# EAGLE design RadioHTC_STM_v3_top_cpu (EAGLE 7.7.0)
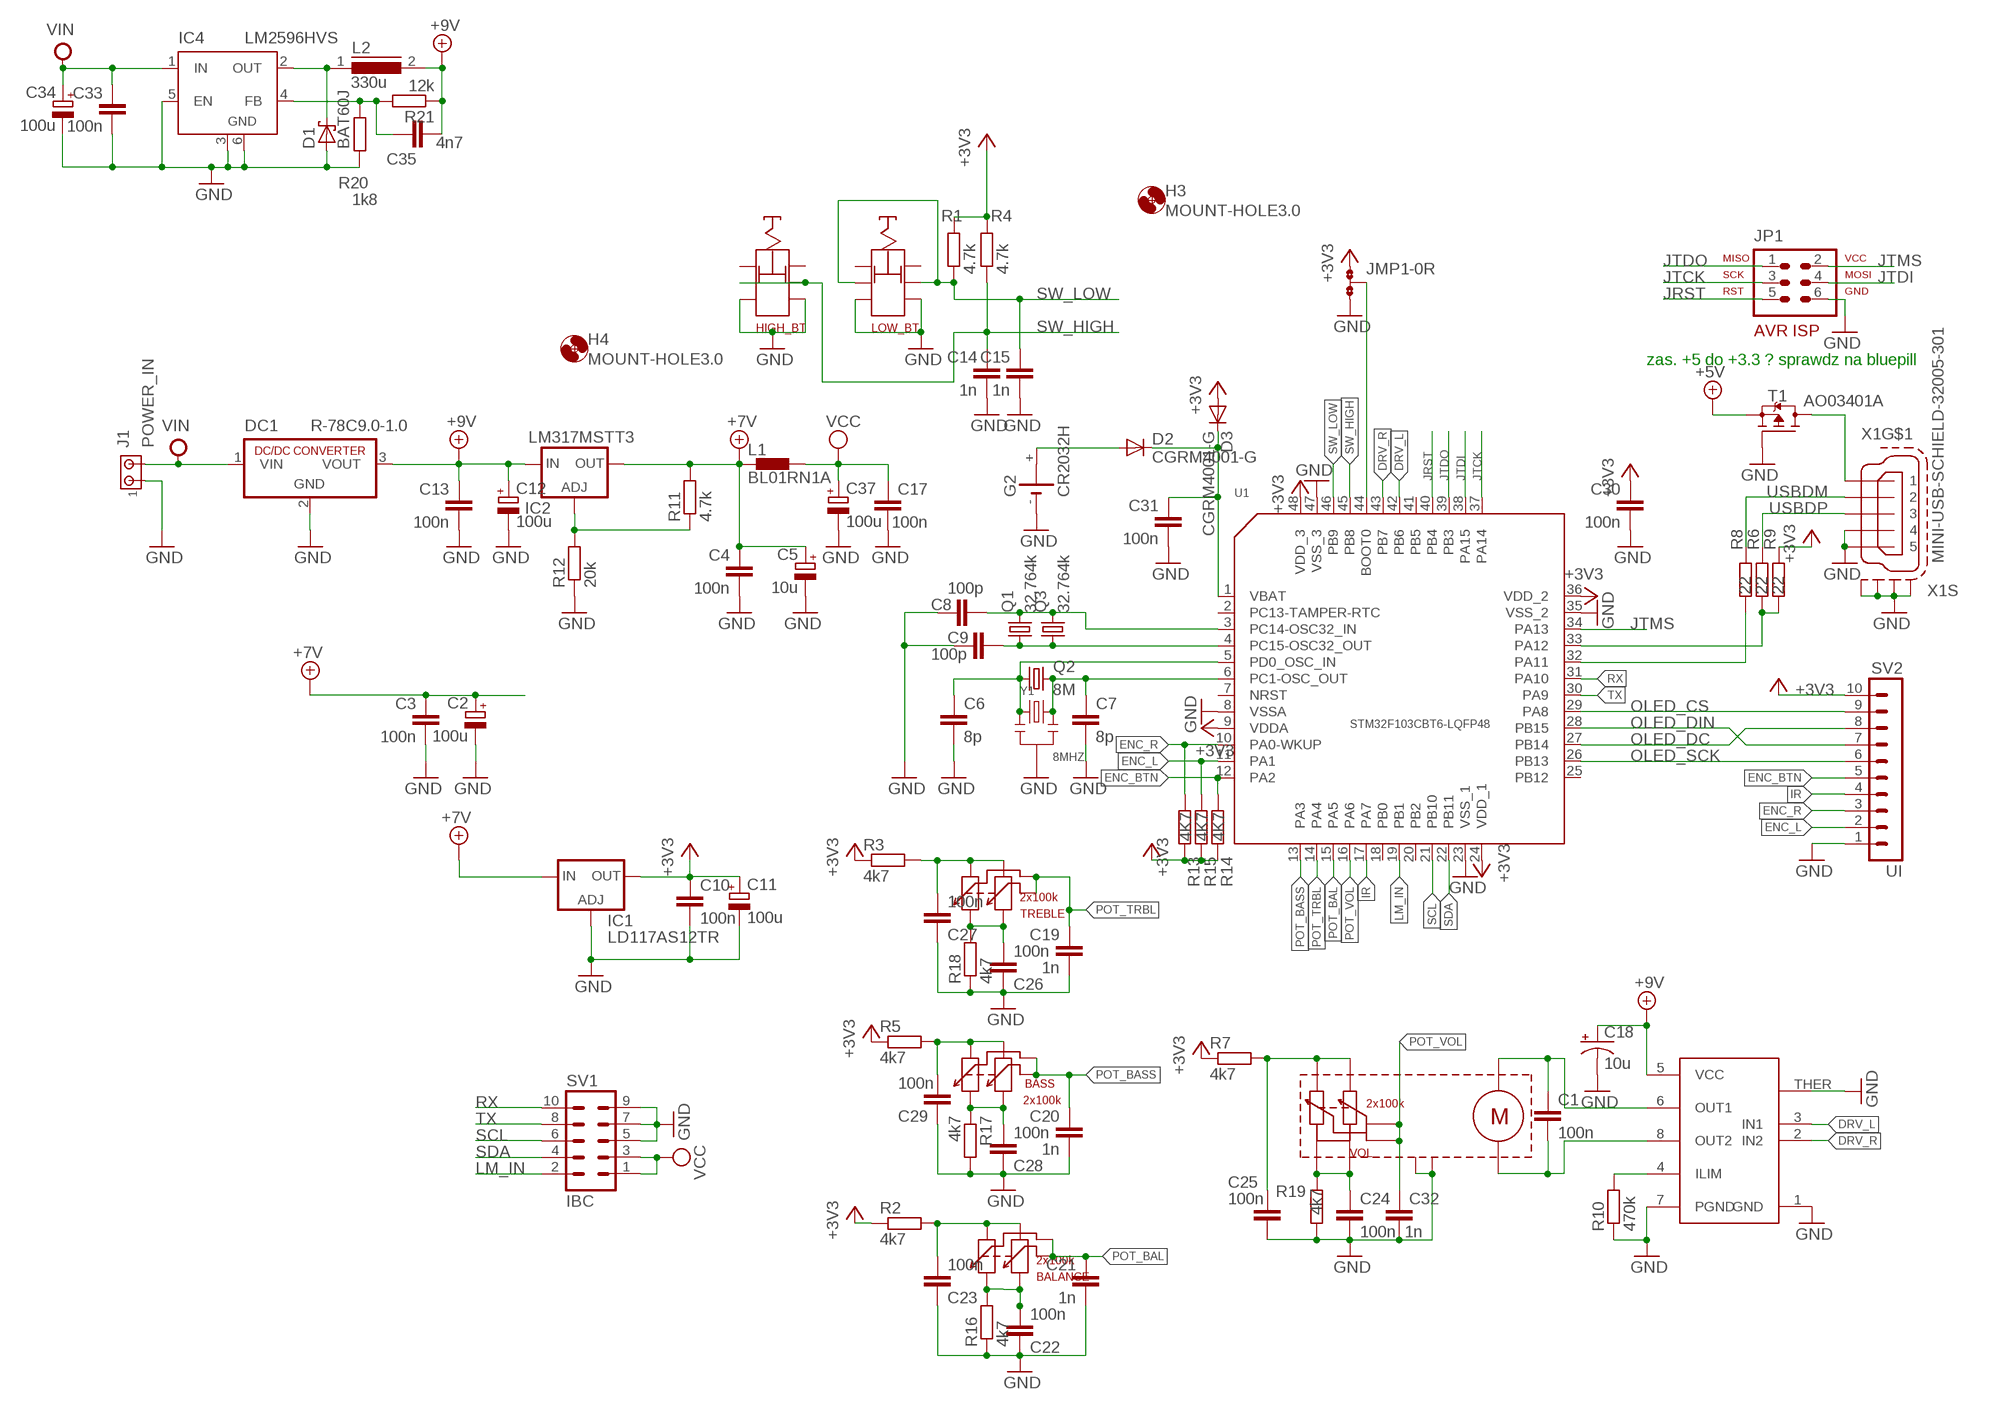
[diagram p0: schematic, sheet 1]

## Parts
BALANCE  2x100k  POT_TONSIL  [POT_VERT_DOUBLE]
BASS  2x100k  POT_TONSIL  [POT_VERT_DOUBLE]
C1  100n  C-EUC1206  [C1206]
C2  100u  CPOL-EUE2-5  [E2-5]
C3  100n  C-EUC1206  [C1206]
C4  100n  C-EUC1206  [C1206]
C5  10u  CPOL-EUE2-5  [E2-5]
C6  8p  C-EUC0805K  [C0805K]
C7  8p  C-EUC0805K  [C0805K]
C8  100p  C-EUC0805K  [C0805K]
C9  100p  C-EUC0805K  [C0805K]
C10  100n  C-EUC1206  [C1206]
C11  100u  CPOL-EUE2-5  [E2-5]
C12  100u  CPOL-EU153CLV-0605  [153CLV-0605]
C13  100n  C-EUC1206  [C1206]
C14  1n  C-EUC1206  [C1206]
C15  1n  C-EUC1206  [C1206]
C17  100n  C-EUC1206  [C1206]
C18  10u  CPOL-US153CLV-0810  [153CLV-0810]
C19  1n  C-EUC1206  [C1206]
C20  1n  C-EUC1206  [C1206]
C21  1n  C-EUC1206  [C1206]
C22  100n  C-EUC1206  [C1206]
C23  100n  C-EUC1206  [C1206]
C24  100n  C-EUC1206  [C1206]
C25  100n  C-EUC1206  [C1206]
C26  100n  C-EUC1206  [C1206]
C27  100n  C-EUC1206  [C1206]
C28  100n  C-EUC1206  [C1206]
C29  100n  C-EUC1206  [C1206]
C30  100n  C-EUC1206  [C1206]
C31  100n  C-EUC1206  [C1206]
C32  1n  C-EUC1206  [C1206]
C33  100n  C-EUC1206  [C1206]
C34  100u  CPOL-EUE2-5  [E2-5]
C35  4n7  C-EUC1206  [C1206]
C37  100u  CPOL-EU153CLV-0405  [153CLV-0405]
D1  BAT60J  [SOD323_ST]
D2  CGRM4001-G  [SOD-123_MINI-SMA]
D3  CGRM4001-G  [SOD-123_MINI-SMA]
DC1  R-78C9.0-1.0  [SIP3]
G2  CR2032H  [CR2032H]
H3  MOUNT-HOLE3.0  [3,0]
H4  MOUNT-HOLE3.0  [3,0]
IC1  LD117AS12TR  [SOT223]
IC2  LM317MSTT3  [SOT223]
IC4  LM2596HVS  LM2596S  [TO263-5]
J1  POWER_IN  MTA02-156  [1X2MTA]
JMP1  0R-JUMPA  [A0R-JMP]
JP1  AVR-ISP-6VERT  [AVR-ISP-6]
L1  BL01RN1A  [BL01RN1A]
L2  330u  DR74  [DR74]
Q1  32.764k  CRYSTALMM39SL  [MM39SL]
Q2  8M  CRYSTALHC49U-V  [HC49U-V]
Q3  32.764k  CRYSTALMM20SS  [MM20SS]
R1  4.7k  R-EU_R1206  [R1206]
R2  4k7  R-EU_R1206  [R1206]
R3  4k7  R-EU_R1206  [R1206]
R4  4.7k  R-EU_R1206  [R1206]
R5  4k7  R-EU_R1206  [R1206]
R6  22  R-EU_R1206  [R1206]
R7  4k7  R-EU_R1206  [R1206]
R8  22  R-EU_R1206  [R1206]
R9  22  R-EU_R1206  [R1206]
R10  470k  R-EU_R1206  [R1206]
R11  4.7k  R-EU_R1206  [R1206]
R12  20k  R-EU_R1206  [R1206]
R13  4K7  R-EU_R1206  [R1206]
R14  4K7  R-EU_R1206  [R1206]
R15  4K7  R-EU_R1206  [R1206]
R16  4k7  R-EU_R1206  [R1206]
R17  4k7  R-EU_R1206  [R1206]
R18  4k7  R-EU_R1206  [R1206]
R19  4k7  R-EU_R1206  [R1206]
R20  1k8  R-EU_R1206  [R1206]
R21  12k  R-EU_R1206  [R1206]
SV1  IBC  ML10  [ML10]
SV2  UI  MA10-1W  [MA10-1W]
SW4  LOW_BT  ISO3  [ISO3]
SW6  HIGH_BT  ISO3  [ISO3]
T1  AO03401A  P-MOSFET  [SOT23-R]
TREBLE  2x100k  POT_TONSIL  [POT_VERT_DOUBLE]
U1  STM32F103CBT6-LQFP48  MCU-STM32F103CBT6(LQFP48)  [LQFP48-0.5-7X7MM]
U2  DRV8871  [DRV8871]
VOL  2x100k  POT_DOUBLE_MOTOR  [POT_DOUBLE_MOTOR]
X1  MINI-USB-SCHIELD-32005-301  [32005-301]
Y1  8MHZ  SMD-RESONATOR-16MHZ-15PF-0.5%-40R(3P-3.2X1.3MM)  [X3-SMD-3.6X1.3X0.8MM]

## Nets
+3V3: C10.1 C11.+ C30.1 D3.A IC1.4(OUT) JMP1.1 R1.2 R2.1 R3.1 R4.2 R5.1 R7.1 R9.2 R13.2 R14.2 R15.2 SV2.10 U1.9(VDDA) U1.24(VDD_1) U1.36(VDD_2) U1.48(VDD_3)
+5V: T1.2(S)
+7V: C2.+ C3.1 C4.1 C5.+ IC1.3(IN) IC2.4(OUT) L1.1 R11.2
+9V: C12.+ C13.1 C18.+ C35.2 DC1.3(VOUT) IC2.3(IN) L2.2 R21.1 U2.5(VCC)
DRV_L: U1.42(PB6) U2.3(IN1)
DRV_R: U1.43(PB7) U2.2(IN2)
ENC_BTN: R14.1 SV2.5 U1.12(PA2)
ENC_L: R15.1 SV2.2 U1.11(PA1)
ENC_R: R13.1 SV2.3 U1.10(PA0-WKUP)
GND: C2.- C3.2 C4.2 C5.- C6.2 C7.2 C8.2 C9.1 C10.2 C11.- C12.- C13.2 C14.2 C15.2 C17.2 C18.- C19.2 C20.2 C21.2 C22.1 C23.1 C24.1 C25.1 C26.1 C27.1 C28.1 C29.1 C30.2 C31.2 C32.2 C33.2 C34.- C37.- D1.A DC1.2(GND) G2.- IC1.1(ADJ) IC4.3(GND) IC4.5(EN) IC4.6(GND) J1.1 JMP1.3 JP1.6 R10.1 R12.1 R16.1 R17.2 R18.1 R19.1 R20.1 SV1.5 SV1.7 SV1.9 SV2.1 SW4.P$3 SW4.P$4 SW6.P$3 SW6.P$4 T1.1(G) U1.8(VSSA) U1.23(VSS_1) U1.35(VSS_2) U1.47(VSS_3) U2.1(GND) U2.7(PGND) U2.THER(GND) VOL.P$9(G) VOL.P$10(G) X1.4 X1.5 X1.M1(S:S1) X1.M2(S:S2) X1.M3(S:S3) X1.M4(S:S4) Y1.2
IR: SV2.4 U1.17(PA7)
JRST: JP1.5 U1.40(PB4)
JTCK: JP1.3 U1.37(PA14)
JTDI: JP1.4 U1.38(PA15)
JTDO: JP1.1 U1.39(PB3)
JTMS: JP1.2 U1.34(PA13)
LM_IN: SV1.2 U1.19(PB1)
N$1: R10.2 U2.4(ILIM)
N$2: C6.1 Q2.1 U1.5(PD0_OSC_IN) Y1.1
N$3: T1.3(D) X1.1
N$4: IC2.1(ADJ) R11.1 R12.2
N$5: C7.1 Q2.2 U1.6(PC1-OSC_OUT) Y1.3
N$6: C9.2 Q1.1 Q3.1 U1.4(PC15-OSC32_OUT)
N$7: JMP1.2 U1.44(BOOT0)
N$8: C8.1 Q1.4 Q3.4 U1.3(PC14-OSC32_IN)
N$9: C35.1 IC4.4(FB) R20.2 R21.2
N$10: R6.1 R9.1 U1.33(PA12)
N$11: C31.1 D2.C D3.C U1.1(VBAT)
N$12: D2.A G2.+
N$13: R8.1 U1.32(PA11)
N$15: BASS.B1 BASS.B2 C28.2 R17.1
N$16: D1.C IC4.2(OUT) L2.1
N$17: BASS.A1 BASS.A2 C29.2 R5.2
N$18: C24.2 R19.2 VOL.P$5 VOL.P$6
N$19: BALANCE.B1 BALANCE.B2 C22.2 R16.2
N$21: C26.2 R18.2 TREBLE.B1 TREBLE.B2
N$39: C27.2 R3.2 TREBLE.A1 TREBLE.A2
N$40: BALANCE.A1 BALANCE.A2 C23.2 R2.2
N$41: C1.1 U2.6(OUT1) VOL.M+
N$42: C1.2 U2.8(OUT2) VOL.M-
N$43: C25.2 R7.2 VOL.P$2 VOL.P$3
OLED_CS: SV2.9 U1.29(PA8)
OLED_DC: SV2.8 U1.27(PB14)
OLED_DIN: SV2.7 U1.28(PB15)
OLED_SCK: SV2.6 U1.26(PB13)
POT_BAL: BALANCE.C1 BALANCE.C2 C21.1 U1.15(PA5)
POT_BASS: BASS.C1 BASS.C2 C20.1 U1.13(PA3)
POT_TRBL: C19.1 TREBLE.C1 TREBLE.C2 U1.14(PA4)
POT_VOL: C32.1 U1.16(PA6) VOL.P$4 VOL.P$7
RX: SV1.10 U1.31(PA10)
SCL: SV1.6 U1.21(PB10)
SDA: SV1.4 U1.22(PB11)
SW_HIGH: C14.1 R4.1 SW6.P$2 SW6.P$5 U1.45(PB8)
SW_LOW: C15.1 R1.1 SW4.P$2 SW4.P$5 U1.46(PB9)
TX: SV1.8 U1.30(PA9)
USBDM: R8.2 X1.2
USBDP: R6.2 X1.3
VCC: C17.1 C37.+ L1.2 SV1.1 SV1.3
VIN: C33.1 C34.+ DC1.1(VIN) IC4.1(IN) J1.2
Unconnected: SW4.P$1 SW4.P$6 SW6.P$1 SW6.P$6 U1.2(PC13-TAMPER-RTC) U1.7(NRST) U1.18(PB0) U1.20(PB2) U1.25(PB12) U1.41(PB5)

## Notes on the sheet
- zas. +5 do +3.3 ? sprawdz na bluepill

## Library data of the parts
BALANCE BASS TREBLE = Isostat:POT_TONSIL
C1 C3 C4 C6-C10 C13-C15 C17 C19-C33 C35 = rcl:C-EU: CAPACITOR, European symbol
C2 C5 C11 C12 C34 C37 = rcl:CPOL-EU: POLARIZED CAPACITOR, European symbol
C18 = rcl:CPOL-US: POLARIZED CAPACITOR, American symbol
D1 = diode:BAT60J: Schottky barrier diode Source: www.st.com, BAT60J.pdf
D2 D3 = diode:CGRM400*-G: Molded plasitc,JEDEC SOD-123/Mini SMA Source: Comchip CGRM4001-G.pdf
DC1 = dc-dc-converter:R-78C*-1.0: INNOLINE DC/DC-Converter 1.0 AMP SIP3 Single Output Source: Data sheet <http://www.mikrocontroller.net/attachment/150645/157764-da-01-en-DC_DC_WANDLER_R_78C5_0_1_0.pdf>
G2 = battery_cr2032:CR2032H: LI BATTERY Varta
H3 H4 = holes:MOUNT-HOLE: MOUNTING HOLE with drill center marker
IC1 = v-reg:LD117A?*: Low drop fixed and adjustable positive voltage regulators 1 A Source: http://www.st.com/stonline/products/literature/ds/7194/ld1117axx.pdf
IC2 = v-reg:LM317?*: 500 mA Adjustable Output Positive Voltage Regulator Source: http://www.onsemi.co.jp .. LM317M-D.PDF
IC4 = linear:LM2596S: STEP-DOWN VOLTAGE REGULATOR
J1 = con-amp:MTA02-156: AMP connector
JMP1 = jump-0r-smd:0R-JUMP: SMD 0R 0805 Jumper
JP1 = avr-7:AVR-ISP-6: AVR ISP-6 Serial Programming Header
L1 = inductors:BL0: Noise Suppression Products/EMI Suppression Filters, Lead EMIFIL(R) Inductor Type Source: http://www.murata.com .. BL01RN1_DS.pdf
L2 = inductors:DR74: High Power Density, High Efficiency, Shielded Inductors Source: coiltronics_dr_series.pdf
Q1 Q3 = crystal:CRYSTAL: CRYSTAL; OC_FARNELL: unknown; OC_NEWARK: unknown
Q2 = crystal:CRYSTAL: CRYSTAL; OC_FARNELL: 1666969; OC_NEWARK: unknown
R1-R21 = rcl:R-EU_: RESISTOR, European symbol
SV1 = con-harting-ml:ML10: HARTING; OC_FARNELL: unknown; OC_NEWARK: unknown
SV2 = con-lstb:MA10-1W: PIN HEADER; OC_FARNELL: unknown; OC_NEWARK: unknown
SW4 SW6 = Isostat:ISO3
T1 = BaseApp:P-MOSFET
U1 = Seeed-OPL-ic:MCU-STM32F103CBT6(LQFP48): 310010004; MPN: STM32F103CBT6
U2 = TEA5767:DRV8871
VOL = Isostat:POT_DOUBLE_MOTOR: TONSIL potenciometer with motor
X1 = con-cypressindustries:MINI-USB-SCHIELD-: MINI USB-B Conector Source: www.cypressindustries.com; OC_FARNELL: unknown; OC_NEWARK: unknown
Y1 = Seeed-OPL-Crystal-Oscillator:SMD-RESONATOR-16MHZ-15PF-0.5%-40R(3P-3.2X1.3MM): 306030002; MPN: CSTCE16M0V53-R0; VALUE: 16MHZ

## Net classes
1 +5V: width 0.813 mm, clearance 0.508 mm
2 w24: width 0.61 mm

## Board
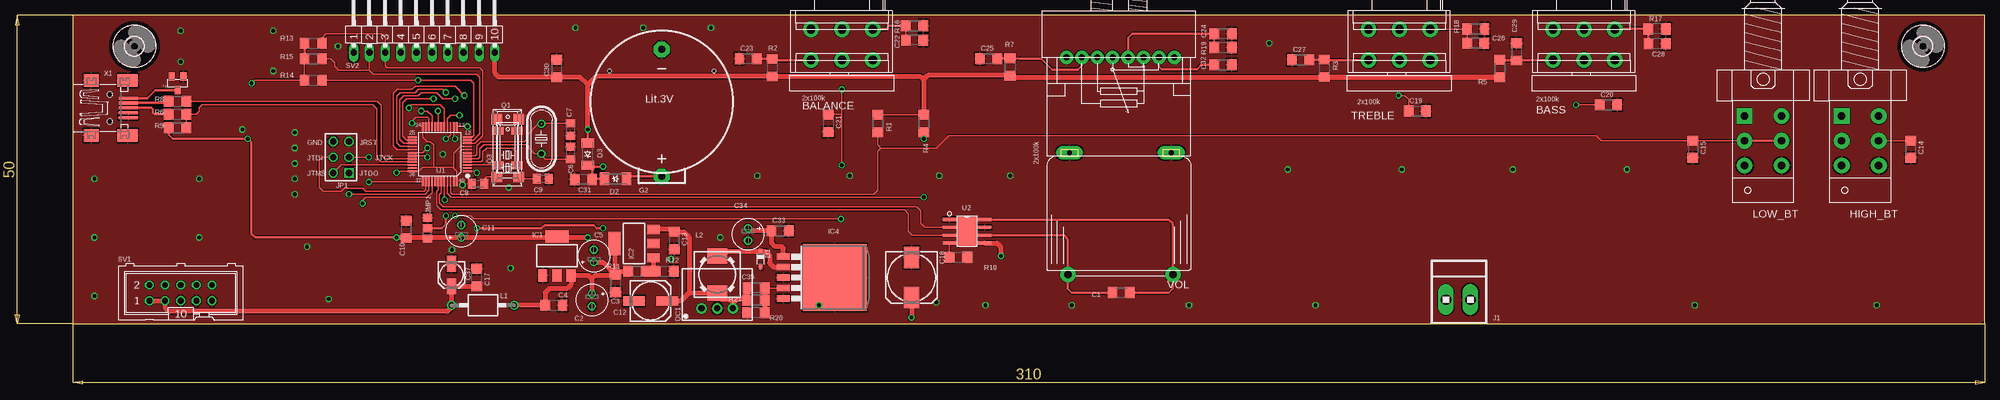
[diagram p1: board, top side]
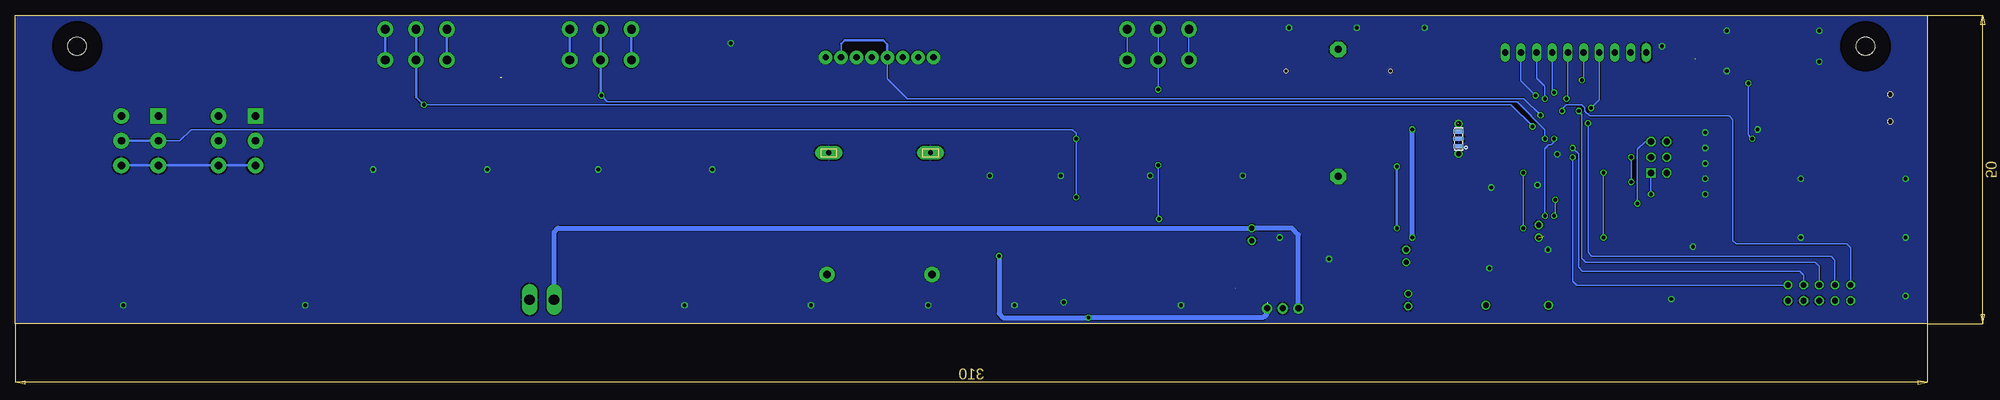
[diagram p2: board, bottom side, seen from below]

Size 310 x 50 mm. Coordinates in mm from the lower left corner, seen from the top.
Outline: 0,0 310,0 310,50 0,50 0,0
Copper layers (1*16): Top 0.035mm / dielectric 1.5mm / Bottom 0.035mm
Design rules "default *": minimum track width 10mil, minimum drill 0.6mm, track to track 4mil, track to pad 8mil, pad to pad 6mil, via to via 8mil, smd to smd 1mil, copper to edge 3mil, drill to drill 8mil, minimum pad ring 10mil, minimum via ring 8mil, stop-mask expansion 4mil, vias tented up to drill 0mil, thermal gap 10mil

### Footprints (pad centres in the part's own frame; a part is rotated, then mirrored left to right if it is on the bottom)
POT_VERT_DOUBLE = drill 1.4 pad 2.54: A1 0,-5; A2 5,-5; B1 0,5; B2 5,5; C1 0,0; C2 5,0
C1206 = smd 1.6 x 1.8: 1 -1.4,0; 2 1.4,0
E2-5 = drill 0.813 pad 1.27: + -1.016,0 | drill 0.813 pad 1.27 octagon: - 1.016,0
C0805K = smd 1.3 x 1.6: 1 -1,0; 2 1,0
153CLV-0605 = smd 3.5 x 1.6: + 2.7,0; - -2.7,0
153CLV-0810 = smd 3.5 x 2.5: + 3.25,0; - -3.25,0
153CLV-0405 = smd 2.6 x 1.6: + 1.8,0; - -1.8,0
SOD323_ST = smd 0.8 x 0.6: A 1.25,0; C -1.25,0
SOD-123_MINI-SMA = smd 1.5 x 2.1: A 1.8,0; C -1.8,0
SIP3 = drill 1 pad 1.676: 1 -2.54,0; 2 0,0; 3 2.54,0
CR2032H = drill 1.118 pad 2.54 octagon: + 0,12.1; - 0,-8.5 | hole 0.6: -8.5,-5; 8.5,-5
3,0 = hole 3: 0,0
SOT223 = smd 1.5 x 2: 1 -2.3,-3.15; 2 0,-3.15; 3 2.3,-3.15 | smd 3.8 x 2: 4 0,3.15
TO263-5 = smd 1.067 x 2.159: 1 -3.404,-5.791; 2 -1.702,-5.791; 3 0,-5.791; 4 1.702,-5.791; 5 3.404,-5.791 | smd 10.8 x 10.41: 6 0,2.54
1X2MTA = drill 1.676 long: 1 1.981,0; 2 -1.981,0
A0R-JMP = smd 1.5 x 1.3: 1 0,1.7; 2 0,0; 3 0,-1.7
AVR-ISP-6 = drill 1.016 square: 1 -2.54,-1.27 | drill 1.016 octagon: 2 -2.54,1.27; 3 0,-1.27; 4 0,1.27; 5 2.54,-1.27; 6 2.54,1.27
BL01RN1A = drill 0.9 pad 1.5: 1 -5.08,0; 2 5.08,0
DR74 = smd 2.5 x 3.25: 1 -3,0; 2 3,0
MM39SL = smd 1.778 x 1.778: 1 -4.699,-1.778; 2 4.699,-1.778; 3 4.699,1.778; 4 -4.699,1.778
HC49U-V = drill 0.813: 1 -2.413,0; 2 2.413,0
MM20SS = smd 1.27 x 1.88: 1 -2.794,-1.524; 2 2.794,-1.524; 3 2.794,1.524; 4 -2.794,1.524
R1206 = smd 1.6 x 1.803: 1 -1.422,0; 2 1.422,0
ML10 = drill 0.914 octagon: 1 -5.08,-1.27; 2 -5.08,1.27; 3 -2.54,-1.27; 4 -2.54,1.27; 5 0,-1.27; 6 0,1.27; 7 2.54,-1.27; 8 2.54,1.27; 9 5.08,-1.27; 10 5.08,1.27
MA10-1W = drill 1.016 long: 1 -11.43,0; 2 -8.89,0; 3 -6.35,0; 4 -3.81,0; 5 -1.27,0; 6 1.27,0; 7 3.81,0; 8 6.35,0; 9 8.89,0; 10 11.43,0
ISO3 = drill 1.2 pad 2.54 square: P$1 0,0 | drill 1.2 pad 2.54: P$2 0,-4; P$3 0,-8; P$4 6,-8; P$5 6,-4; P$6 6,0
SOT23-R = smd 1 x 1.4: 1 -0.95,-1.1; 2 0.95,-1.1; 3 0,1.1
LQFP48-0.5-7X7MM = smd 1.5 x 0.3: 1 -4.45,2.75; 2 -4.45,2.25; 3 -4.45,1.75; 4 -4.45,1.25; 5 -4.45,0.75; 6 -4.45,0.25; 7 -4.45,-0.25; 8 -4.45,-0.75; 9 -4.45,-1.25; 10 -4.45,-1.75; 11 -4.45,-2.25; 12 -4.45,-2.75; 25 4.45,-2.75; 26 4.45,-2.25; 27 4.45,-1.75; 28 4.45,-1.25; 29 4.45,-0.75; 30 4.45,-0.25; 31 4.45,0.25; 32 4.45,0.75; 33 4.45,1.25; 34 4.45,1.75; 35 4.45,2.25; 36 4.45,2.75 | smd 0.3 x 1.5: 13 -2.75,-4.45; 14 -2.25,-4.45; 15 -1.75,-4.45; 16 -1.25,-4.45; 17 -0.75,-4.45; 18 -0.25,-4.45; 19 0.25,-4.45; 20 0.75,-4.45; 21 1.25,-4.45; 22 1.75,-4.45; 23 2.25,-4.45; 24 2.75,-4.45; 37 2.75,4.45; 38 2.25,4.45; 39 1.75,4.45; 40 1.25,4.45; 41 0.75,4.45; 42 0.25,4.45; 43 -0.25,4.45; 44 -0.75,4.45; 45 -1.25,4.45; 46 -1.75,4.45; 47 -2.25,4.45; 48 -2.75,4.45
DRV8871 = smd 0.5 x 2.2: 1 -1.905,-2.857; 2 -0.635,-2.857; 3 0.635,-2.857; 4 1.905,-2.857; 5 1.905,2.858; 6 0.635,2.858; 7 -0.635,2.858; 8 -1.905,2.858 | smd 4.9 x 2.95: THER 0,0
POT_DOUBLE_MOTOR = drill 1.2 pad 2.5: M+ 0.25,-35.2; M- 17.25,-35.2 | drill 1 pad 2.184: P$1 0,0; P$2 2.5,0; P$3 5,0; P$4 7.5,0; P$5 10,0; P$6 12.5,0; P$7 15,0; P$8 17.5,0 | drill 0.8 pad 2.2 long: P$9 17,-15.5; P$10 0.5,-15.5
32005-301 = smd 3.1 x 0.5: 1 3,1.6; 2 3,0.8; 3 3,0; 4 3,-0.8; 5 3,-1.6 | smd 2.5 x 2: M1 -3,-4.45; M2 -3,4.45 | smd 3.3 x 2: M3 2.9,4.45; M4 2.9,-4.45 | hole 0.9: 0,2.2; 0,-2.2
X3-SMD-3.6X1.3X0.8MM = smd 0.7 x 1.7: 1 -1.2,0; 2 0,0; 3 1.2,0

### Placement (x,y rotation side)
BALANCE  124.71,47.75 270 top
BASS  245.04,47.75 270 top
C1  170,5.07 0 top
C2  84.18,3.85 270 top
C3  88,6.5 270 top
C4  78,3 0 top
C5  84.5,11 90 top
C6  80.7,27.7 90 top
C7  80.7,31.5 270 top
C8  65.7,22.7 180 top
C9  76.2,23.5 180 top
C10  54.1,15.3 90 top
C11  63,15 90 top
C12  93.7,3.7 0 top
C13  97.5,13.5 270 top
C14  298,28.3 270 top
C15  262.7,28.3 270 top
C17  65.5,7.5 90 top
C18  136,7.5 270 top
C19  218,34.5 0 top
C20  249,35.5 0 top
C21  122.5,32.5 270 top
C22  136.5,46 180 top
C23  109.5,43 0 top
C24  186.5,47 180 top
C25  148.5,43 0 top
C26  227.5,45.5 180 top
C27  199.1,42.8 0 top
C28  256.9,45.4 180 top
C29  234.1,44.1 270 top
C30  78.5,41.4 90 top
C31  82.8,23.4 180 top
C32  186.5,42 0 top
C33  114.7,15.1 0 top
C34  109.5,14.5 270 top
C35  110.8,5.8 180 top
C37  61.4,7.9 270 top
D1  111.5,10.5 270 top
D2  88,23.5 0 top
D3  83.5,27.5 90 top
DC1  104.5,2.5 0 top
G2  95.5,36 180 top
H3  300,45 0 top
H4  10,45 0 top
IC1  78.5,11 0 top
IC2  91,13 90 top
IC4  121,7.5 270 top
J1  224.64,3.9 0 top
JMP1  57.5,15.5 180 top
JP1  43.5,27 90 top
L1  66.5,3 180 top
L2  104.5,8 270 top
Q1  70.5,28.5 90 top
Q2  76,30 90 top
Q3  70.5,28.5 90 top
R1  130.5,32.5 90 top
R2  113.39,41.52 90 top
R3  202.92,41.43 90 top
R4  138,32.5 90 top
R5  231.4,41.4 90 top
R6  17,34 180 top
R7  151.97,41.63 90 top
R8  17,36.1 180 top
R9  17,31.8 180 top
R10  143.6,10.8 180 top
R11  91.5,8.5 180 top
R12  96,8.5 180 top
R13  39,45.5 180 top
R14  39,39.5 180 top
R15  39,43 180 top
R16  136.5,48.3 180 top
R17  256.9,47.8 0 top
R18  227.5,47.8 180 top
R19  186.5,44.8 180 top
R20  110.8,1.8 0 top
R21  110.8,3.8 0 top
SV1  17.5,5 0 top
SV2  57,44 0 top
SW4  271.09,33.67 0 top
SW6  286.83,33.67 0 top
T1  17,39 180 top
TREBLE  215.11,47.75 270 top
U1  59.5,27.5 180 top
U2  145,15 270 top
VOL  161.12,43.21 0 top
X1  6,35 0 top
Y1  76,30 90 bottom

### Tracks (layer width: path | path; a pad name or v marks a point on that pad's centre or on a via)
+3V3  (via drill 0.6)  (3 unrouted)
  Top 0.254: U1.9 62.88,28.75 61.75,27.61 61.75,25.25 | U1.48 62.25,24.75 61.75,25.25 | 61.75,25.25 61.62,25.39 58.5,25.39 | 58.5,25.39 56.75,25.39 56.12,24.75 U1.36 52.75,24.75 v52.5,24.5 | 138.09,34.01 R4.2 R1.2 | R7.1 151.88,40.3 | U1.24 56.75,30.25 57.5,29.5 58,29.5 58.5,29 58.5,25.39 | JMP1.1 62.2,14.2 62,14 | R14.2 37.5,39.5 | 37.5,39.5 29.5,39.5 v29,39 | 37.5,42.92 37.5,39.5 | v52.5,14 54,14 C10.1
  Top 0.406: R9.2 15.58,30.64 16.21,30 v28.36,30 28.93,29.43 28.93,14.63 29.57,14 v52.5,14 | 83.5,31 D3.A v83.5,31.5 | R13.2 R15.2
  Top 0.813: SV2.10 68.43,40.63 69.06,40 C30.1 82.23,40 83.5,38.73 | R3.1 231.13,40 151.58,40 151.88,40.3 138.63,40.3 138,39.66 138,39.5 | v52.5,14 62,14 v83.5,14 78.65,14 IC1.4 | v83.5,31.5 83.5,38.73 | 138,39.5 R4.2 | 138,39.5 137.4,40.1 R2.1 84.87,40.1 83.5,38.73
  Bottom 0.254: v52.5,24.5 v52.5,14 | v29,39 29,30.64 v28.36,30
  Bottom 0.813: v83.5,14 v83.5,31.5
+7V
  Top 0.813: C3.1 84.81,7.9 84.18,7.26 | C3.1 88.6,8.5 R11.2 | IC2.4 87.85,8.05 C3.1 | 84.18,7.26 C2.+ | 84.18,7.26 83.59,7.85 IC1.3 80.8,6.33 80.17,5.7 77.23,5.7 76.6,5.07 C4.1 L1.1 | C5.+ 85.92,9.98 C3.1
+9V  (via drill 0.6)  (1 unrouted)
  Top 0.813: U2.5 149.87,13.1 150.5,12.46 v150.5,11 | IC2.3 97.2,15.3 97.5,15 C13.1 99.1,14.9 100,14 100,5 | C18.+ v136,1 | C35.2 109.38,5.78 R21.1 109.18,4 107.67,4 107.04,3.37 DC1.3 | 107.04,3.46 106.5,4 105.14,4 104.5,4.63 L2.2 100,5 | C12.+ 98.7,3.7 100,5
  Bottom 0.813: v150.5,11 150.5,1.64 149.87,1 v136,1 107.67,1 107.04,1.64 DC1.3
DRV_L
  Top 0.254: U1.42 59.25,21.75 59,21.5 59,19.14 59.63,18.5 134.87,18.5 135.5,17.86 135.5,15 136.13,14.37 U2.3
DRV_R
  Top 0.254: U1.43 59.75,21.25 59.4,20.9 59.4,19.64 60.03,19 136.87,19 137.5,18.36 137.5,16.27 138.13,15.63 U2.2
ENC_BTN  (via drill 0.6)
  Top 0.254: U1.12 64.75,30.25 65,30.5 65,39 64.5,39.5 v56,39.5 R14.1
  Bottom 0.254: v56,39.5 55.73,39.77 SV2.5
ENC_L
  Top 0.254: U1.11 64.95,29.75 66,30.8 66,40 65.5,40.5 48.74,40.5 48.11,41.13 | 48.11,41.13 SV2.2 | R15.1 41.87,43 42.5,42.37 42.5,41.77 43.13,41.13 48.11,41.13
ENC_R
  Top 0.254: U1.10 65.25,29.25 66.5,30.5 66.5,41 66,41.5 51,41.5 50.65,41.85 SV2.3 50.65,46.37 50.02,47 41.06,47 40.42,46.37 R13.1
GND  (via drill 0.6)
  Top 0.254: U1.8 63.05,28.25 62.7,27.9 62.8,27.8 62.8,25.4 | 142.12,16.93 U2.1 | U2.7 145.63,15.63 U2.THER
  Bottom 0.406: SW4.P$3 SW6.P$4
  other vias: 61.5,12 201.5,3 41.5,4 20.5,14 17.5,42.5 152,24 27.5,31.5 32.5,41 71,9 111,24 126,24 140.5,24 97,10.5 121,3 140,3.5 17.5,47.5 32.5,47.5 263,3 292.5,3 197,25 215.5,25 233.5,25 252,25 81.5,48 103.5,48 92.5,48 148,3 162,3 181,3 70.7,22.1 60,27.5 194,45.5 3.5,4.5 38,12.5 3.5,14 3.5,23.5 105,14 20.5,23.5 63.2,22.5 36,31 36,28.5 36,26 36,23.5 36,21 43,45
  pour Top: 0,50.16 309.25,50.16 309.88,49.53 309.88,27.94 309.88,0.64 309.25,0 0,0 0,49.53
  pour Bottom: 0,50 0,0.64 0.64,0 310,0 310,49.37 309.37,50
  pour Top (no thermals): 144,22 146,22 146.5,4 144,4
IR  (via drill 0.6)
  Top 0.254: v54.5,35 55,35.5 59.62,35.5 60.25,34.87 U1.17
  Bottom 0.254: SV2.4 53.19,36.31 v54.5,35
JRST  (via drill 0.6)
  Top 0.254: U1.40 58.25,21.25 57.5,20.5 47.5,20.5 47,20 v47,19.5
  Bottom 0.254: v47,19.5 47,28.27 45.73,29.54 JP1.5
JTCK  (via drill 0.6)
  Top 0.254: JP1.3 v48,27 | v48,23 48.55,23.05 U1.37
  Bottom 0.254: v48,27 v48,23
JTDI
  Top 0.254: U1.38 57.25,21.75 57,21.5 47.5,21.5 47,22 44,22 43.5,21.5 40.63,21.5 40,22.14 40,26.5 40.5,27 JP1.4
JTDO  (via drill 0.6)
  Top 0.254: U1.39 57.75,21.64 57.12,21 v44.8,21
  Bottom 0.254: v44.8,21 44.8,24.43 JP1.1
JTMS
  Top 0.254: JP1.2 42.23,24.48 43.5,25.75 U1.34
LM_IN  (via drill 0.6)
  Top 0.254: U1.19 59.25,34.45 v59.2,34.5
  Bottom 0.254: v59.2,34.5 59.2,34.87 58.56,35.5 56,35.5 55.5,35 55.5,34.5 54.7,33.7 32.13,33.7 31.5,33.06 31.5,13.5 31,13 13.05,13 12.42,12.37 SV1.2
N$1
  Top 0.254: U2.4 142.14,10.84 R10.2
N$2
  Top 0.254: U1.5 65.75,26.75 66,27 66,28.36 66.64,29 73.75,29 74,28.75 74,28.5 74.91,27.59 Q2.1 76,27.34 76.64,26.7 C6.1
  Bottom 0.254: Q2.1 Y1.1
N$3
  Top 0.406: X1.1 12.1,36.6 13.4,37.9 T1.3
N$4
  Top 0.813: R11.1 R12.2 94.15,8.93 IC2.1
N$5  (1 unrouted)
  Top 0.254: U1.6 65.25,27.25 65.5,27.5 65.5,28.86 66.14,29.5 73.25,29.5 73.5,29.75 73.5,30.45 75.47,32.41 Q2.2 | C7.1 76.09,32.5
  Bottom 0.254: Y1.3 Q2.2
N$6
  Top 0.254: U1.4 66.25,26.25 66.5,26.5 66.5,27.86 67.14,28.5 71.39,28.5 72.02,27.86 Q3.1 72.28,25.45 Q1.1 | Q1.1 72.28,23.78 | C9.2 72.58,23.5 Q1.1
N$7  (via drill 0.6)
  Top 0.254: U1.44 60.25,20.15 v60.3,20.1
  Top 0.406: JMP1.2 59.87,15.5 60.5,16.14 v60.5,17.5
  Bottom 0.254: v60.3,20.1 60.3,17.7 v60.5,17.5
N$8
  Top 0.254: U1.3 68.09,25.75 68.72,25.11 Q1.4 | Q1.4 68.7,23.78 | Q3.4 68.72,25.45 Q1.4 | Q1.4 67.1,23.8 66.7,23.4 C8.1
N$9  (1 unrouted)
  Top 0.254: IC4.4 112.22,5.8 | 112,2.18 R20.2
  Top 0.406: 112,2.18 112.22,2.18 R21.2
  Top 0.813: C35.1 112.2,1.82 R20.2
N$10
  Top 0.254: R9.1 R6.1 20,34 20.5,34.5 20.5,35 21,35.5 48.66,35.5 49.3,34.87 49.3,26.89 49.94,26.25 U1.33
N$11  (via drill 0.6)
  Top 0.254: U1.1 65.25,24.75 v65.5,24.5
  Top 0.406: v86,15.5 85,15.5 84.5,16 76.5,16 76,15.5 v65.5,15.5 | D3.C 83.85,25.35 | 83.85,25.35 84.2,25 C31.1 84.3,23.5 D2.C | v86,25.5 84,25.5 83.85,25.35
  Bottom 0.254: v65.5,24.5 v65.5,15.5
  Bottom 0.406: v86,15.5 v86,25.5
N$12
  Top 0.406: D2.A 90.2,23.9 G2.+
N$13
  Top 0.254: R8.1 49.37,36.1 50,35.47 50,27.39 50.63,26.75 U1.32
N$15
  Top 0.254: 250.09,47.8 BASS.B1 | C28.2 255.48,45.48
  Top 0.406: 250.09,47.8 R17.1 255.48,45.48
  Bottom 0.406: BASS.B1 BASS.B2
N$16
  Top 0.813: IC4.2 113.64,9.2 113,9.84 113,11.12 112.36,11.75 D1.C 105.14,11.75 104.5,11.12 L2.1
N$17
  Top 0.254: 239.99,42.7 BASS.A2
  Top 0.406: 239.99,42.7 C29.2 231.52,42.7 R5.2
  Bottom 0.406: BASS.A1 BASS.A2
N$18
  Top 0.254: R19.2 185.08,46.37 184.97,46.47 | 184.97,46.47 184.44,47 | VOL.P$5 VOL.P$6 | C24.2 185.1,46.6 184.97,46.47
  Top 0.406: 184.44,47 171.75,47 171.12,46.37 VOL.P$5
N$19
  Top 0.254: R16.2 135.1,48.28 C22.2
  Top 0.406: BALANCE.B1 131.75,47.75 132.3,48.3 R16.2
  Bottom 0.254: BALANCE.B2 BALANCE.B1
N$21
  Top 0.254: C26.2 226.1,47.9 226,48 226,47.88 R18.2 226.03,47.75 TREBLE.B1
  Bottom 0.406: TREBLE.B1 TREBLE.B2
N$39
  Top 0.254: 203.02,42.75 R3.2 202.87,42.8
  Top 0.406: TREBLE.A2 203.02,42.75 | C27.2 202.87,42.8
  Bottom 0.406: TREBLE.A1 TREBLE.A2
N$40
  Top 0.406: C23.2 110.96,42.94 R2.2 113.58,42.75 BALANCE.A2
  Bottom 0.254: BALANCE.A2 BALANCE.A1
N$41
  Top 0.254: 168.74,5.21 C1.1
  Top 0.406: U2.6 160.74,14.37 161.37,13.73 VOL.M+ 161.37,5.71 162,5.07 C1.1
N$42
  Top 0.254: 171.28,5.18 C1.2
  Top 0.406: U2.8 177.74,16.91 178.37,16.27 VOL.M- 178.37,5.71 177.74,5.07 C1.2
N$43
  Top 0.254: C25.2 149.95,43.05
  Top 0.406: 149.95,43.05 R7.2 153.58,43 157,43 158.8,41.2 162.99,41.2 163.62,41.84 VOL.P$2 VOL.P$3
OLED_CS  (via drill 0.6)
  Top 0.254: U1.29 52.63,28.25 52,28.89 52,37.37 52.63,38 55,38 55.5,38.5 62,38.5 v63.5,37
  Bottom 0.254: v63.5,37 65.89,39.39 SV2.9
OLED_DC  (via drill 0.6)
  Top 0.254: U1.27 53.63,29.25 53,29.89 53,36.37 53.63,37 56,37 56.5,37.5 59,37.5 60,36.5 v62,36.5
  Bottom 0.254: v62,36.5 62,38.5 63.35,39.85 SV2.8
OLED_DIN  (via drill 0.6)
  Top 0.254: U1.28 53.13,28.75 52.5,29.39 52.5,36.87 53.13,37.5 55.5,37.5 56,38 60,38 v60.5,37.5
  Bottom 0.254: v60.5,37.5 60.81,37.81 SV2.7
OLED_SCK  (via drill 0.6)
  Top 0.254: U1.26 54.5,29.75 54.13,29.75 53.5,30.39 53.5,35.87 54.13,36.5 v58.5,36.5
  Bottom 0.254: v58.5,36.5 58.27,36.77 SV2.6
POT_BAL  (via drill 0.6)
  Top 0.254: v62,17.5 64.5,17.5 65,17 v124.56,17 | v124.7,38 124.7,34 | 124.7,34 v124.7,25.7 | v60.5,30 60.62,30 61.25,30.64 U1.15 | C21.1 122.6,34 124.7,34
  Bottom 0.254: v124.7,25.7 124.7,17.64 v124.56,17 | v60.5,30 60.5,29.5 61,29 61.37,29 62,28.36 v62,17.5 | BALANCE.C1 BALANCE.C2 v124.71,38.01 v124.7,38
POT_BASS  (via drill 0.6)
  Top 0.254: U1.13 62.3,32 v64,32 | C20.1 v243.77,35.5
  Bottom 0.254: v64,32 67.5,35.5 243,35.5 v243.77,35.5
  Bottom 0.406: BASS.C1 BASS.C2 245.04,36.77 v243.77,35.5
POT_TRBL  (via drill 0.6)
  Top 0.254: v62,30 61.75,30.25 U1.14 | C19.1 216.6,36.38 215.97,37.01 v214.99,37.01
  Bottom 0.254: v62,30 62,31.5 66.5,36 214,36 214.5,36.5 214.47,36.5 v214.99,37.01 215.11,37.13
  Bottom 0.406: TREBLE.C1 TREBLE.C2 215.11,37.13
POT_VOL  (via drill 0.6)
  Top 0.254: U1.16 60.75,33.25 61.3,33.8 v62.7,33.8
  Top 0.406: VOL.P$7 176.12,41.78 176.6,41.3 182.3,41.3 183,42 C32.1
  Bottom 0.254: v62.7,33.8 65.4,36.5 165.41,36.5 168.62,39.72 VOL.P$4 | 176.12,45.38 VOL.P$7
  Bottom 0.406: VOL.P$4 168.62,45.37 169.25,46 175.5,46 176.12,45.38
RX  (via drill 0.6)
  Top 0.254: v57.5,27 57.25,27.25 U1.31
  Bottom 0.254: v57.5,27 57.5,6.91 56.87,6.27 SV1.10
SCL  (via drill 0.6)
  Top 0.254: v56.5,34.5 57.48,34.5 58.25,33.73 U1.21
  Bottom 0.254: v56.5,34.5 56,34 56,10.63 55.37,10 18.14,10 17.5,9.37 SV1.6
SDA  (via drill 0.6)
  Top 0.254: U1.22 57.75,33.37 57.62,33.5 55.63,33.5 55,32.87 v55,32.5
  Bottom 0.254: v55,32.5 55,11.6 54.37,10.96 15.6,10.96 14.96,10.32 SV1.4
SW_HIGH  (via drill 0.6)
  Top 0.254: SW6.P$5 297.97,29.67 C14.1 | U1.45 60.75,21.14 61.38,20.5 v138,20.5 | R4.1 v138,30
  Bottom 0.254: SW6.P$2 283.33,29.67 281.5,31.5 138.63,31.5 138,30.86 v138,30 v138,20.5
  Bottom 0.406: SW6.P$2 SW6.P$5
SW_LOW
  Top 0.254: 131,28.5 140,28.5 142,30.5 247,30.5 247.83,29.67 SW4.P$2 271.06,29.7 C15.1 | U1.46 61.25,21.25 61.5,21 129.87,21 130.5,21.64 130.5,28 131,28.5 | R1.1 130.5,29 131,28.5
  Top 0.406: SW4.P$2 SW4.P$5
TX  (via drill 0.6)
  Top 0.254: v57.5,28.5 56.75,27.75 U1.30
  Bottom 0.254: v57.5,28.5 56.54,27.54 56.54,9.13 55.91,8.5 20.68,8.5 20.04,7.87 SV1.8
USBDM
  Top 0.406: X1.2 15.38,35.8 R8.2
USBDP
  Top 0.406: R6.2 13.25,34 13,34.25 13,34.75 12.75,35 X1.3
VCC
  Top 0.813: SV1.1 SV1.3 14.96,2.63 15.6,2 60.78,2 61.42,2.63 L1.2 61.42,6.08 C37.+ C17.1
VIN
  Top 0.813: IC4.1 115.21,12.29 115,12.5 113.94,12.5 113.3,13.13 C33.1 109.5,15.1 C34.+
  Bottom 0.813: DC1.1 101.96,14.46 103,15.5 109.48,15.5 C34.+ 222.02,15.52 222.66,14.88 J1.2

### Text on the board
tPlace: GND | JTCK | JTMS
tNames: JRST | JTDI | JTDO
tValues: + | -
Document: volume | selector | speakers | aux | b | bass | treble | balance | tuner | phono | a | a+b | 0 | 0 | 0 | power | 2 | 2 | 2 | 2 | filters | 4 | 4 | 4 | 4 | 0 | 6 | 6 | 6 | 6 | high | low | 8 | 8 | 8 | 8 | phones | - 10 | 10 + | - 10 | 10 + | left | right | UNITRA | FONICA | STEREO INTEGRATED AMPLIFIER PW 9013